# Altium schematic sheet BW1098OAK_Project_Information.SchDoc: =project_title
size Tabloid; CompanyName: Luxonis Holding; Organization: Luxonis Holding; Address1: 1925 Harmony Park Drive; Address2: Westminster, CO; Address3: 80234; Address4: United States; SheetNumber: 1; SheetTotal: 11
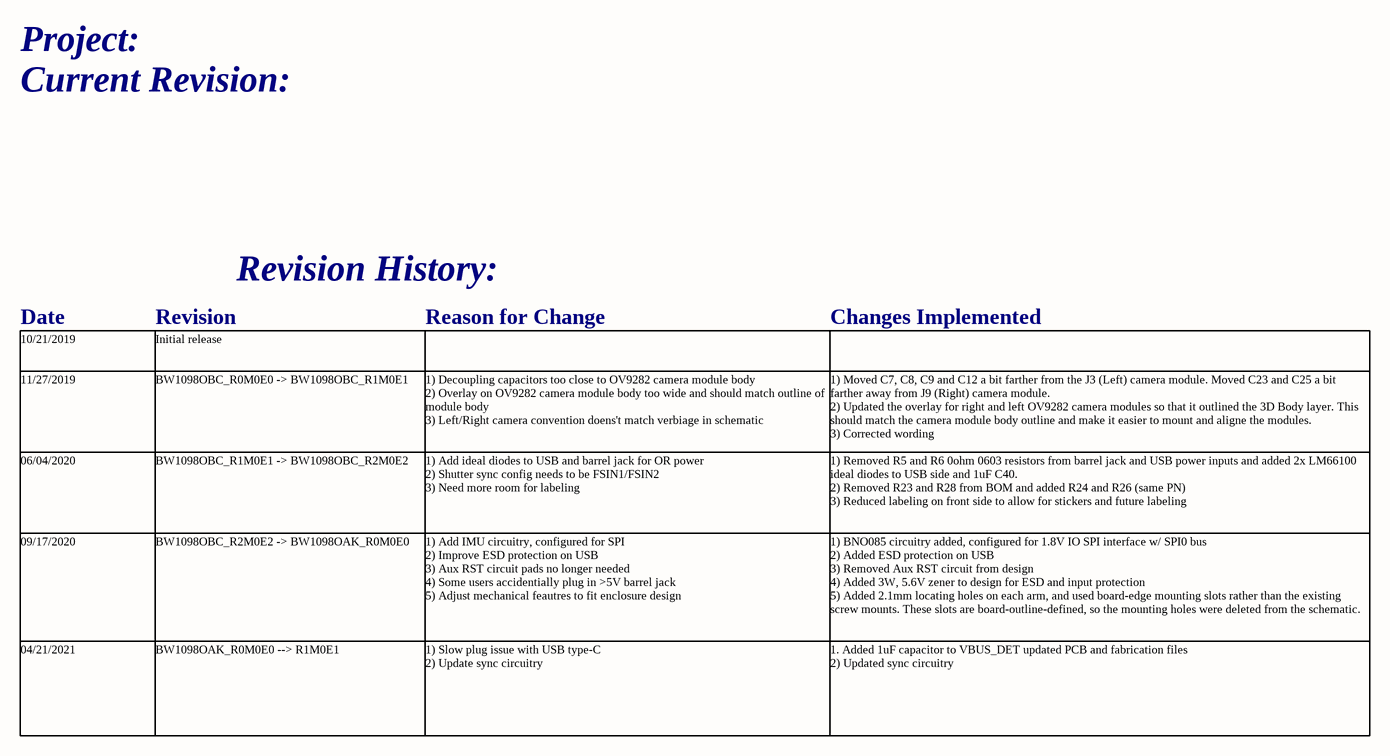
[diagram p0: BW1098OAK_Project_Information.SchDoc]

## Notes on the sheet
- Project:
- Current Revision:
- Revision History:
- 10/21/2019
- Date
- Initial release
- Revision
- Reason for Change
- Changes Implemented
- 11/27/2019
- BW1098OBC_R0M0E0 -> BW1098OBC_R1M0E1
- 1) Decoupling capacitors too close to OV9282 camera module body
  2) Overlay on OV9282 camera module body too wide and should match outline of module body
  3) Left/Right camera convention doens't match verbiage in schematic
- 1) Moved C7, C8, C9 and C12 a bit farther from the J3 (Left) camera module. Moved C23 and C25 a bit farther away from J9 (Right) camera module.
  2) Updated the overlay for right and left OV9282 camera modules so that it outlined the 3D Body layer. This should match the camera module body outline and make it easier to mount and aligne the modules.
  3) Corrected wording
- 06/04/2020
- BW1098OBC_R1M0E1 -> BW1098OBC_R2M0E2
- 1) Add ideal diodes to USB and barrel jack for OR power
  2) Shutter sync config needs to be FSIN1/FSIN2
  3) Need more room for labeling
- 1) Removed R5 and R6 0ohm 0603 resistors from barrel jack and USB power inputs and added 2x LM66100 ideal diodes to USB side and 1uF C40.
  2) Removed R23 and R28 from BOM and added R24 and R26 (same PN)
  3) Reduced labeling on front side to allow for stickers and future labeling
- 09/17/2020
- BW1098OBC_R2M0E2 -> BW1098OAK_R0M0E0
- 1) Add IMU circuitry, configured for SPI
  2) Improve ESD protection on USB
  3) Aux RST circuit pads no longer needed
  4) Some users accidentially plug in >5V barrel jack
  5) Adjust mechanical feautres to fit enclosure design
- 1) BNO085 circuitry added, configured for 1.8V IO SPI interface w/ SPI0 bus
  2) Added ESD protection on USB
  3) Removed Aux RST circuit from design
  4) Added 3W, 5.6V zener to design for ESD and input protection
  5) Added 2.1mm locating holes on each arm, and used board-edge mounting slots rather than the existing screw mounts. These slots are board-outline-defined, so the mounting holes were deleted from the schematic.
- 04/21/2021
- BW1098OAK_R0M0E0 --> R1M0E1
- 1) Slow plug issue with USB type-C
  2) Update sync circuitry
- 1. Added 1uF capacitor to VBUS_DET updated PCB and fabrication files
  2) Updated sync circuitry
- Title
- Size:
- Date:
- Tabloid
- Number:
- Time:
- Revision:
- Sheet
- of
- Drawn by: